# Altium project SmartStethoscope.PrjPcb
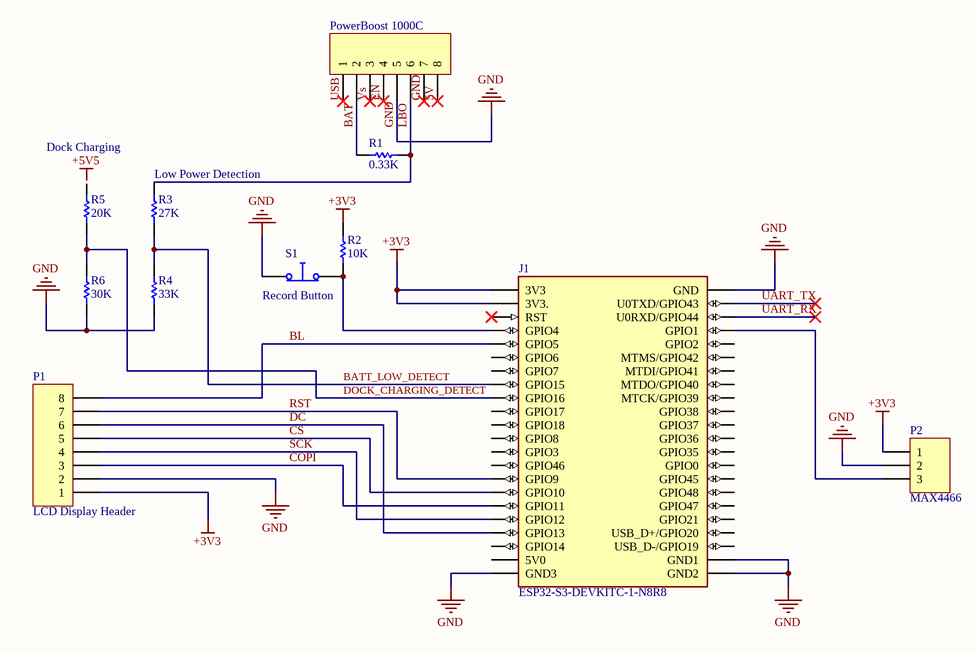
[diagram p0: TopLevel.SchDoc]
1 sheet, 11 parts. Net scope: global (net labels, ports and power ports of the same name join across sheets).

## Sheet TopLevel.SchDoc
size A4; SheetNumber: 1; SheetTotal: 1

### Parts
J1  ESP32-S3-DEVKITC-1-N8R8  [ESP32-S3-DEVKITC-1-N8R8]
P1  LCD Display Header  [HDR1X8]
P2  MAX4466  [HDR1X3]
PowerBoost_1000C  CD Display Header  [HDR1X8]  (value not drawn)
R1  value 0.33K  (hidden comment: Resistor)
R2  value 10K  (hidden comment: Resistor)
R3  value 27K  (hidden comment: Resistor)
R4  value 33K  (hidden comment: Resistor)
R5  value 20K  (hidden comment: Resistor)
R6  value 30K  (hidden comment: Resistor)
S1  Push Button Normally Closed  (value not drawn)

### Nets
+3V3: J1.J1_1(3V3) J1.J1_2(3V3.) P1.1 P2.1 R2.2
+5V5: R5.2
GND: J1.J1_22(GND3) J1.J3_1(GND) J1.J3_21(GND1) J1.J3_22(GND2) P1.2 P2.2 PowerBoost_1000C.5 PowerBoost_1000C.7 R4.1 R6.1 S1.1
5V: PowerBoost_1000C.8
BAT: PowerBoost_1000C.2 R1.2
BATT_LOW_DETECT: J1.J1_8(GPIO15) R3.1 R4.2
BL: J1.J1_5(GPIO5) P1.8
COPI: J1.J1_17(GPIO11) P1.3
CS: J1.J1_16(GPIO10) P1.5
DC: J1.J1_19(GPIO13) P1.6
DOCK_CHARGING_DETECT: J1.J1_9(GPIO16) R5.1 R6.2
EN: PowerBoost_1000C.4
LBO: PowerBoost_1000C.6 R1.1 R3.2
RST: J1.J1_15(GPIO9) P1.7
SCK: J1.J1_18(GPIO12) P1.4
UART_RX: J1.J3_3(U0RXD/GPIO44)
UART_TX: J1.J3_2(U0TXD/GPIO43)
USB: PowerBoost_1000C.1
Vs: PowerBoost_1000C.3
NetJ1_J1_4: J1.J1_4(GPIO4) R2.1 S1.2
NetJ1_J3_4: J1.J3_4(GPIO1) P2.3

Not connected (* = marked no-connect by the designer): J1 J1_3(RST)* J1_6(GPIO6) J1_7(GPIO7) J1_10(GPIO17) J1_11(GPIO18) J1_12(GPIO8) J1_13(GPIO3) J1_14(GPIO46) J1_20(GPIO14) J1_21(5V0) J3_5(GPIO2) J3_6(MTMS/GPIO42) J3_7(MTDI/GPIO41) J3_8(MTDO/GPIO40) J3_9(MTCK/GPIO39) J3_10(GPIO38) J3_11(GPIO37) J3_12(GPIO36) J3_13(GPIO35) J3_14(GPIO0) J3_15(GPIO45) J3_16(GPIO48) J3_17(GPIO47) J3_18(GPIO21) J3_19(USB_D+/GPIO20) J3_20(USB_D-/GPIO19)

### Notes on the sheet
- Dock Charging
- (near R3) Low Power Detection
- (near S1) Record Button

### Library data of the parts
J1 = CMP-002-000000-1: The ESP32-S3-DEVKITC-1-N8R8 from Espressif Systems is a development board designed for RF, RFID, and wireless applications. It supports 802.11 b/g/n Wi-Fi and BluetoothÂ® 5.x (BLE) connectivity at 2.4GHz, making it ideal for IoT and wireless communication; Design Item ID: ESP32-S3-DEVKITC-1-N8R8; Component Type: Standard; Value: *; Package: None; Check_prices: https://www.snapeda.com/parts/ESP32-S3-DEVKITC-1-N8R8/Espressif+Systems/view-part/?ref=eda; Source: ESP32-S3-DEVKITC-1-N8R8.SchLib; SnapEDA_Link: https://www.snapeda.com/parts/ESP32-S3-DEVKITC-1-N8R8/Espressif+Systems/view-part/?ref=snap; MP: ESP32-S3-DEVKITC-1-N8R8; Pin Count: 44; MF: Espressif Systems
P1 PowerBoost_1000C = CMP-006-000117-1: Header, 8-Pin; Signal Integrity: Connector; Source: Miscellaneous Connectors.SchLib; LatestRevisionNote: Re-released for DXP Platform.; Design Item ID: Header 8; Component Type: Standard; Pin Count: 8; LatestRevisionDate: 17-Jul-2002; Publisher: Altium Limited
P2 = CMP-006-000090-1: Header, 3-Pin; Signal Integrity: Connector; Source: Miscellaneous Connectors.SchLib; Design Item ID: Header 3; LatestRevisionDate: 17-Jul-2002; LatestRevisionNote: Re-released for DXP Platform.; Publisher: Altium Limited; Component Type: Standard; Pin Count: 3
R1-R6 = Resistor: TC1: 0; SimulationGenericComponent: True; TC2: 0
S1 = Push Button NC: closed: 1; Rclosed: 1m; Ropen: 1Meg; SimulationGenericComponent: True